# EAGLE board ArduSatMultipleProcessorModule (EAGLE 6.3), part 1 of 2
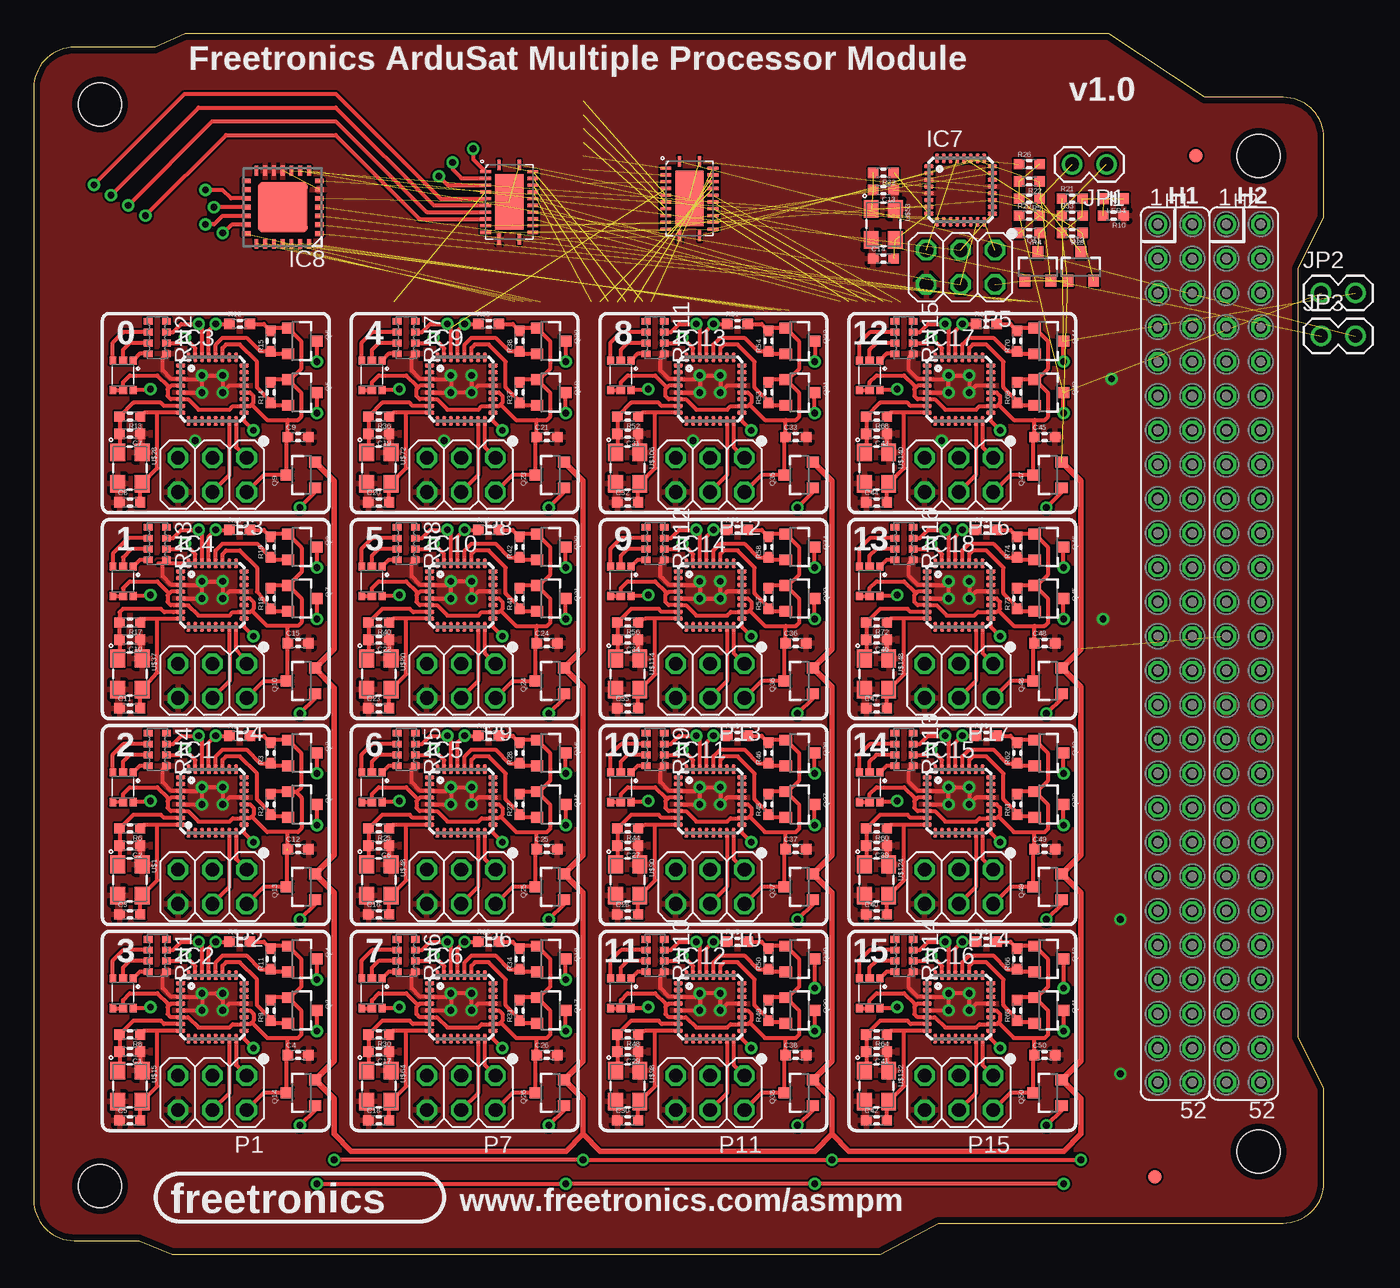
[diagram p2: board, top side]
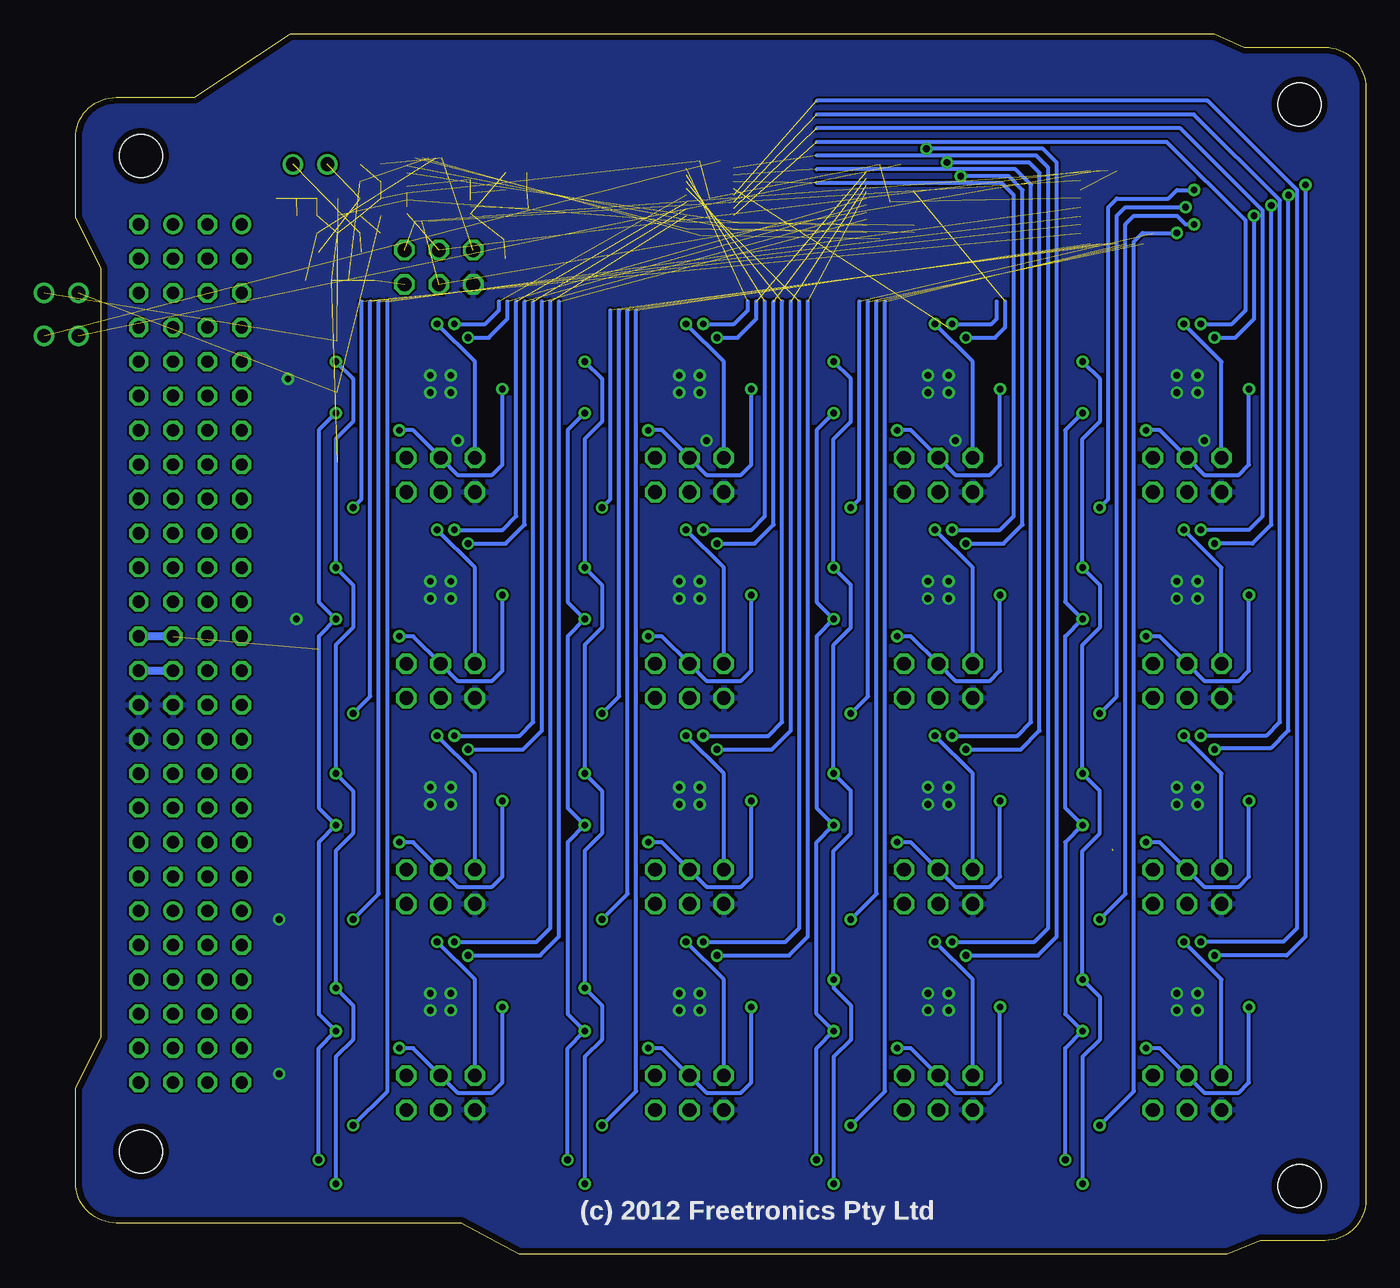
[diagram p3: board, bottom side, seen from below]

Size 95.45 x 90.3 mm. Coordinates in mm from the lower left corner, seen from the top.
Outline: 0,4 arc90 3,1 7.81,1 10.23,0 62.65,0 66.94,2.3 92.45,2.3 arc90 95.45,5.3 95.45,12.31 93.55,16.05 93.55,72.91 95.45,76.74 95.45,82.6 arc90 92.45,85.6 86.64,85.6 79.56,90.3 11.2,90.3 9,89.3 3,89.3 arc90 0,86.3 0,4
Copper layers (1*16): Top 0.035mm / dielectric 1.5mm / Bottom 0.035mm
Design rules "default": minimum track width 6mil, minimum drill 24mil, track to track 6mil, track to pad 12mil, pad to pad 12mil, via to via 12mil, smd to smd 8mil, copper to edge 18mil, drill to drill 8mil, minimum pad ring 10mil, minimum via ring 8mil, stop-mask expansion 4mil, vias tented up to drill 0mil, thermal gap 10mil
Holes 3.2 mm at 4.91,5.05 4.91,85.07 90.63,81.26 90.63,7.6

## Footprints (pad centres in the part's own frame; a part is rotated, then mirrored left to right if it is on the bottom)
0603 = smd 0.762 x 0.762: 1 -0.762,0; 2 0.762,0
CUBESATBUS = drill 0.914: 1 -31.75,-1.27; 41 19.05,-1.27 | drill 0.914 octagon: 2 -31.75,1.27; 3 -29.21,-1.27; 4 -29.21,1.27; 5 -26.67,-1.27; 6 -26.67,1.27; 7 -24.13,-1.27; 8 -24.13,1.27; 9 -21.59,-1.27; 10 -21.59,1.27; 11 -19.05,-1.27; 12 -19.05,1.27; 13 -16.51,-1.27; 14 -16.51,1.27; 15 -13.97,-1.27; 16 -13.97,1.27; 17 -11.43,-1.27; 18 -11.43,1.27; 19 -8.89,-1.27; 20 -8.89,1.27; 21 -6.35,-1.27; 22 -6.35,1.27; 23 -3.81,-1.27; 24 -3.81,1.27; 25 -1.27,-1.27; 26 -1.27,1.27; 27 1.27,-1.27; 28 1.27,1.27; 29 3.81,-1.27; 30 3.81,1.27; 31 6.35,-1.27; 32 6.35,1.27; 33 8.89,-1.27; 34 8.89,1.27; 35 11.43,-1.27; 36 11.43,1.27; 37 13.97,-1.27; 38 13.97,1.27; 39 16.51,-1.27; 40 16.51,1.27; 42 19.05,1.27; 43 21.59,-1.27; 44 21.59,1.27; 45 24.13,-1.27; 46 24.13,1.27; 47 26.67,-1.27; 48 26.67,1.27; 49 29.21,-1.27; 50 29.21,1.27; 51 31.75,-1.27; 52 31.75,1.27
MLF32 = smd 0.7 x 0.3: 1 -2.35,1.75; 2 -2.35,1.25; 3 -2.35,0.75; 4 -2.35,0.25; 5 -2.35,-0.25; 6 -2.35,-0.75; 7 -2.35,-1.25; 8 -2.35,-1.75; 17 2.35,-1.75; 18 2.35,-1.25; 19 2.35,-0.75; 20 2.35,-0.25; 21 2.35,0.25; 22 2.35,0.75; 23 2.35,1.25; 24 2.35,1.75 | smd 0.3 x 0.7: 9 -1.75,-2.35; 10 -1.25,-2.35; 11 -0.75,-2.35; 12 -0.25,-2.35; 13 0.25,-2.35; 14 0.75,-2.35; 15 1.25,-2.35; 16 1.75,-2.35; 25 1.75,2.35; 26 1.25,2.35; 27 0.75,2.35; 28 0.25,2.35; 29 -0.25,2.35; 30 -0.75,2.35; 31 -1.25,2.35; 32 -1.75,2.35
QFN28-ML_6X6MM = smd 0.7 x 0.35: 1 -2.7,1.95; 2 -2.7,1.3; 3 -2.7,0.65; 4 -2.7,0; 5 -2.7,-0.65; 6 -2.7,-1.3; 7 -2.7,-1.95; 15 2.7,-1.95; 16 2.7,-1.3; 17 2.7,-0.65; 18 2.7,0; 19 2.7,0.65; 20 2.7,1.3; 21 2.7,1.95 | smd 0.35 x 0.7: 8 -1.95,-2.7; 9 -1.3,-2.7; 10 -0.65,-2.7; 11 0,-2.7; 12 0.65,-2.7; 13 1.3,-2.7; 14 1.95,-2.7; 22 1.95,2.7; 23 1.3,2.7; 24 0.65,2.7; 25 0,2.7; 26 -0.65,2.7; 27 -1.3,2.7; 28 -1.95,2.7 | smd 3.7 x 3.7: EXP 0,0
1X02 = drill 1.016: 1 0,0; 2 2.54,0
LED-0603 = smd 0.8 x 0.8: A 0,-0.75; C 0,0.75
2X03PTH = drill 1.016 octagon: 1 -2.54,-1.27; 2 -2.54,1.27; 3 0,-1.27; 4 0,1.27; 5 2.54,-1.27; 6 2.54,1.27
SOT23-3 = smd 0.8 x 0.9: 1 -0.95,-1; 2 0.95,-1; 3 0,1.1
CAY16 = smd 0.5 x 0.65: 1 -1.2,-0.675; 2 -0.4,-0.675; 3 0.4,-0.675; 4 1.2,-0.675; 5 1.2,0.675; 6 0.4,0.675; 7 -0.4,0.675; 8 -1.2,0.675
CRYSTAL-SMD-3X2 = smd 1.3 x 1.1: 1 -1.15,-0.9; 2 1.15,-0.9; 3 1.15,0.9; 4 -1.15,0.9
19-337 = smd 0.6 x 0.5: 1 -1.1,0.75; 3 -1.1,-0.75; 4 1.1,0.75; 6 1.1,-0.75 | smd 0.6 x 0.6: 2 -1.1,0; 5 1.1,0
FIDUCIAL-1X2.5 = smd 1 x 1: 1 0,0
DHVQFN24 = smd 0.8 x 0.23: 1 -2.75,-0.75; 12 2.75,-0.75; 13 2.75,0.75; 24 -2.75,0.75 | smd 0.24 x 0.8: 2 -2.25,-1.75 | smd 0.23 x 0.8: 3 -1.75,-1.75; 4 -1.25,-1.75; 5 -0.75,-1.75; 6 -0.25,-1.75; 7 0.25,-1.75; 8 0.75,-1.75; 9 1.25,-1.75; 10 1.75,-1.75; 11 2.25,-1.75; 14 2.25,1.75; 15 1.75,1.75; 16 1.25,1.75; 17 0.75,1.75; 18 0.25,1.75; 19 -0.25,1.75; 20 -0.75,1.75; 21 -1.25,1.75; 22 -1.75,1.75; 23 -2.25,1.75 | smd 4.1 x 2.1: 25 0,0

## Placement (x,y rotation side)
C1  22pF 0603  [0603]  7.11,14.99 180 top
C2  22pF 0603  [0603]  7.11,30.23 180 top
C3  22pF 0603  [0603]  7.11,25.15 0 top
C4  100nF 0603  [0603]  19.56,14.73 0 top
C5  22pF 0603  [0603]  7.11,9.91 0 top
C6  22pF 0603  [0603]  25.53,30.23 180 top
C7  22pF 0603  [0603]  7.11,60.71 180 top
C8  22pF 0603  [0603]  7.11,55.63 0 top
C9  100nF 0603  [0603]  19.56,60.45 0 top
C10  22pF 0603  [0603]  7.11,45.47 180 top
C11  22pF 0603  [0603]  7.11,40.39 0 top
C12  100nF 0603  [0603]  19.56,29.97 0 top
C13  22pF 0603  [0603]  62.87,78.74 180 top
C14  22pF 0603  [0603]  62.87,73.66 0 top
C15  100nF 0603  [0603]  19.56,45.21 0 top
C16  22pF 0603  [0603]  25.53,25.15 0 top
C17  22pF 0603  [0603]  25.53,14.99 180 top
C18  22pF 0603  [0603]  25.53,9.91 0 top
C19  22pF 0603  [0603]  25.53,60.71 180 top
C20  22pF 0603  [0603]  25.53,55.63 0 top
C21  100nF 0603  [0603]  37.97,60.45 0 top
C22  22pF 0603  [0603]  25.53,45.47 180 top
C23  22pF 0603  [0603]  25.53,40.39 0 top
C24  100nF 0603  [0603]  37.97,45.21 0 top
C25  100nF 0603  [0603]  37.97,29.97 0 top
C26  100nF 0603  [0603]  37.97,14.73 0 top
C27  22pF 0603  [0603]  43.94,30.23 180 top
C28  22pF 0603  [0603]  43.94,25.15 0 top
C29  22pF 0603  [0603]  43.94,14.99 180 top
C30  22pF 0603  [0603]  43.94,9.91 0 top
C31  22pF 0603  [0603]  43.94,60.71 180 top
C32  22pF 0603  [0603]  43.94,55.63 0 top
C33  100nF 0603  [0603]  56.39,60.45 0 top
C34  22pF 0603  [0603]  43.94,45.47 180 top
C35  22pF 0603  [0603]  43.94,40.39 0 top
C36  100nF 0603  [0603]  56.39,45.21 0 top
C37  100nF 0603  [0603]  56.39,29.97 0 top
C38  100nF 0603  [0603]  56.39,14.73 0 top
C39  22pF 0603  [0603]  62.36,30.23 180 top
C40  22pF 0603  [0603]  62.36,25.15 0 top
C41  22pF 0603  [0603]  62.36,14.99 180 top
C42  22pF 0603  [0603]  62.36,9.91 0 top
C43  22pF 0603  [0603]  62.36,60.71 180 top
C44  22pF 0603  [0603]  62.36,55.63 0 top
C45  100nF 0603  [0603]  74.8,60.45 0 top
C46  22pF 0603  [0603]  62.36,45.47 180 top
C47  22pF 0603  [0603]  62.36,40.39 0 top
C48  100nF 0603  [0603]  74.8,45.21 0 top
C49  100nF 0603  [0603]  74.8,29.97 0 top
C50  100nF 0603  [0603]  74.8,14.73 0 top
H1  CUBESATBUSH  [CUBESATBUS]  84.44,44.45 270 top
H2  CUBESATBUSH  [CUBESATBUS]  89.52,44.45 270 top
IC1  ATMEGA328P  [MLF32]  13.21,33.53 0 top
IC2  ATMEGA328P  [MLF32]  13.21,18.29 0 top
IC3  ATMEGA328P  [MLF32]  13.21,64.01 0 top
IC4  ATMEGA328P  [MLF32]  13.21,48.77 0 top
IC5  ATMEGA328P  [MLF32]  31.62,33.53 0 top
IC6  ATMEGA328P  [MLF32]  31.62,18.29 0 top
IC7  ATMEGA328P  [MLF32]  68.58,78.74 0 top
IC8  MCP23S17ML  [QFN28-ML_6X6MM]  18.41,77.47 180 top
IC9  ATMEGA328P  [MLF32]  31.62,64.01 0 top
IC10  ATMEGA328P  [MLF32]  31.62,48.77 0 top
IC11  ATMEGA328P  [MLF32]  50.04,33.53 0 top
IC12  ATMEGA328P  [MLF32]  50.04,18.29 0 top
IC13  ATMEGA328P  [MLF32]  50.04,64.01 0 top
IC14  ATMEGA328P  [MLF32]  50.04,48.77 0 top
IC15  ATMEGA328P  [MLF32]  68.45,33.53 0 top
IC16  ATMEGA328P  [MLF32]  68.45,18.29 0 top
IC17  ATMEGA328P  [MLF32]  68.45,64.01 0 top
IC18  ATMEGA328P  [MLF32]  68.45,48.77 0 top
JP1  [1X02]  79.38,80.64 180 top
JP2  [1X02]  95.25,71.12 0 top
JP3  [1X02]  95.25,67.94 0 top
LED4  PWR/BLUE  [LED-0603]  79.88,78.11 90 top
P1  N1_ICSP  [2X03PTH]  13.21,11.94 180 top
P2  N0_ICSP  [2X03PTH]  13.21,27.18 180 top
P3  N0_ICSP  [2X03PTH]  13.21,57.66 180 top
P4  N1_ICSP  [2X03PTH]  13.21,42.42 180 top
P5  N1_ICSP  [2X03PTH]  68.58,73.03 180 top
P6  N0_ICSP  [2X03PTH]  31.62,27.18 180 top
P7  N1_ICSP  [2X03PTH]  31.62,11.94 180 top
P8  N0_ICSP  [2X03PTH]  31.62,57.66 180 top
P9  N1_ICSP  [2X03PTH]  31.62,42.42 180 top
P10  N0_ICSP  [2X03PTH]  50.04,27.18 180 top
P11  N1_ICSP  [2X03PTH]  50.04,11.94 180 top
P12  N0_ICSP  [2X03PTH]  50.04,57.66 180 top
P13  N1_ICSP  [2X03PTH]  50.04,42.42 180 top
P14  N0_ICSP  [2X03PTH]  68.45,27.18 180 top
P15  N1_ICSP  [2X03PTH]  68.45,11.94 180 top
P16  N0_ICSP  [2X03PTH]  68.45,57.66 180 top
P17  N1_ICSP  [2X03PTH]  68.45,42.42 180 top
Q1  BSS138 N-MOSFET  [SOT23-3]  19.81,33.27 270 top
Q2  BSS138 N-MOSFET  [SOT23-3]  19.81,37.08 270 top
Q3  BSS138 N-MOSFET  [SOT23-3]  19.81,18.03 270 top
Q4  BSS138 N-MOSFET  [SOT23-3]  19.81,21.84 270 top
Q5  BSS138 N-MOSFET  [SOT23-3]  19.81,63.75 270 top
Q6  BSS138 N-MOSFET  [SOT23-3]  19.81,67.56 270 top
Q7  BSS138 N-MOSFET  [SOT23-3]  19.81,48.51 270 top
Q8  BSS138 N-MOSFET  [SOT23-3]  19.81,52.32 270 top
Q9  2N7002 N-MOSFET  [SOT23-3]  19.81,57.66 90 top
Q10  2N7002 N-MOSFET  [SOT23-3]  19.81,42.42 90 top
Q11  BSS138 N-MOSFET  [SOT23-3]  74.3,73.03 0 top
Q12  BSS138 N-MOSFET  [SOT23-3]  77.47,73.03 0 top
Q13  2N7002 N-MOSFET  [SOT23-3]  19.81,27.18 90 top
Q14  2N7002 N-MOSFET  [SOT23-3]  19.81,11.94 90 top
Q15  BSS138 N-MOSFET  [SOT23-3]  38.23,33.27 270 top
Q16  BSS138 N-MOSFET  [SOT23-3]  38.23,37.08 270 top
Q17  BSS138 N-MOSFET  [SOT23-3]  38.23,18.03 270 top
Q18  BSS138 N-MOSFET  [SOT23-3]  38.23,21.84 270 top
Q19  BSS138 N-MOSFET  [SOT23-3]  38.23,63.75 270 top
Q20  BSS138 N-MOSFET  [SOT23-3]  38.23,67.56 270 top
Q21  BSS138 N-MOSFET  [SOT23-3]  38.23,48.51 270 top
Q22  BSS138 N-MOSFET  [SOT23-3]  38.23,52.32 270 top
Q23  2N7002 N-MOSFET  [SOT23-3]  38.23,57.66 90 top
Q24  2N7002 N-MOSFET  [SOT23-3]  38.23,42.42 90 top
Q25  2N7002 N-MOSFET  [SOT23-3]  38.23,27.18 90 top
Q26  2N7002 N-MOSFET  [SOT23-3]  38.23,11.94 90 top
Q27  BSS138 N-MOSFET  [SOT23-3]  56.64,33.27 270 top
Q28  BSS138 N-MOSFET  [SOT23-3]  56.64,37.08 270 top
Q29  BSS138 N-MOSFET  [SOT23-3]  56.64,18.03 270 top
Q30  BSS138 N-MOSFET  [SOT23-3]  56.64,21.84 270 top
Q31  BSS138 N-MOSFET  [SOT23-3]  56.64,63.75 270 top
Q32  BSS138 N-MOSFET  [SOT23-3]  56.64,67.56 270 top
Q33  BSS138 N-MOSFET  [SOT23-3]  56.64,48.51 270 top
Q34  BSS138 N-MOSFET  [SOT23-3]  56.64,52.32 270 top
Q35  2N7002 N-MOSFET  [SOT23-3]  56.64,57.66 90 top
Q36  2N7002 N-MOSFET  [SOT23-3]  56.64,42.42 90 top
Q37  2N7002 N-MOSFET  [SOT23-3]  56.64,27.18 90 top
Q38  2N7002 N-MOSFET  [SOT23-3]  56.64,11.94 90 top
Q39  BSS138 N-MOSFET  [SOT23-3]  75.06,33.27 270 top
Q40  BSS138 N-MOSFET  [SOT23-3]  75.06,37.08 270 top
Q41  BSS138 N-MOSFET  [SOT23-3]  75.06,18.03 270 top
Q42  BSS138 N-MOSFET  [SOT23-3]  75.06,21.84 270 top
Q43  BSS138 N-MOSFET  [SOT23-3]  75.06,63.75 270 top
Q44  BSS138 N-MOSFET  [SOT23-3]  75.06,67.56 270 top
Q45  BSS138 N-MOSFET  [SOT23-3]  75.06,48.51 270 top
Q46  BSS138 N-MOSFET  [SOT23-3]  75.06,52.32 270 top
Q47  2N7002 N-MOSFET  [SOT23-3]  75.06,57.66 90 top
Q48  2N7002 N-MOSFET  [SOT23-3]  75.06,42.42 90 top
Q49  2N7002 N-MOSFET  [SOT23-3]  75.06,27.18 90 top
Q50  2N7002 N-MOSFET  [SOT23-3]  75.06,11.94 90 top
R1  22K 0603  [0603]  15.24,38.35 0 top
R2  10K 0603  [0603]  17.53,33.27 90 top
R3  10K 0603  [0603]  17.53,37.08 90 top
R4  100K 0603  [0603]  73.66,75.56 180 top
R5  100K 0603  [0603]  73.66,78.11 180 top
R6  1M 0603  [0603]  7.11,31.5 180 top
R7  22K 0603  [0603]  15.24,23.11 0 top
R8  1M 0603  [0603]  7.11,16.26 180 top
R9  10K 0603  [0603]  17.53,18.03 90 top
R10  2K2 0603  [0603]  79.88,76.83 180 top
R11  10K 0603  [0603]  17.53,21.84 90 top
R12  22K 0603  [0603]  15.24,68.83 0 top
R13  1M 0603  [0603]  7.11,61.98 180 top
R14  10K 0603  [0603]  17.53,63.75 90 top
R15  10K 0603  [0603]  17.53,67.56 90 top
R16  22K 0603  [0603]  15.24,53.59 0 top
R17  1M 0603  [0603]  7.11,46.74 180 top
R18  10K 0603  [0603]  17.53,48.51 90 top
R19  10K 0603  [0603]  17.53,52.32 90 top
R20  100K 0603  [0603]  73.66,76.83 0 top
R21  100K 0603  [0603]  76.83,78.11 0 top
R22  10K 0603  [0603]  73.66,79.38 180 top
R23  10K 0603  [0603]  76.83,75.56 180 top
R24  22K 0603  [0603]  33.66,38.35 0 top
R25  1M 0603  [0603]  25.53,31.5 180 top
R26  22K 0603  [0603]  73.66,80.64 0 top
R27  10K 0603  [0603]  35.94,33.27 90 top
R28  10K 0603  [0603]  35.94,37.08 90 top
R29  22K 0603  [0603]  33.66,23.11 0 top
R30  1M 0603  [0603]  25.53,16.26 180 top
R31  10K 0603  [0603]  35.94,18.03 90 top
R32  1M 0603  [0603]  62.87,80.01 180 top
R33  33K 0603  [0603]  76.83,76.83 0 top
R34  10K 0603  [0603]  35.94,21.84 90 top
R35  22K 0603  [0603]  33.66,68.83 0 top
R36  1M 0603  [0603]  25.53,61.98 180 top
R37  10K 0603  [0603]  35.94,63.75 90 top
R38  10K 0603  [0603]  35.94,67.56 90 top
R39  22K 0603  [0603]  33.66,53.59 0 top
R40  1M 0603  [0603]  25.53,46.74 180 top
R41  10K 0603  [0603]  35.94,48.51 90 top
R42  10K 0603  [0603]  35.94,52.32 90 top
R43  22K 0603  [0603]  52.07,38.35 0 top
R44  1M 0603  [0603]  43.94,31.5 180 top
R45  10K 0603  [0603]  54.36,33.27 90 top
R46  10K 0603  [0603]  54.36,37.08 90 top
R47  22K 0603  [0603]  52.07,23.11 0 top
R48  1M 0603  [0603]  43.94,16.26 180 top
R49  10K 0603  [0603]  54.36,18.03 90 top
R50  10K 0603  [0603]  54.36,21.84 90 top
R51  22K 0603  [0603]  52.07,68.83 0 top
R52  1M 0603  [0603]  43.94,61.98 180 top
R53  10K 0603  [0603]  54.36,63.75 90 top
R54  10K 0603  [0603]  54.36,67.56 90 top
R55  22K 0603  [0603]  52.07,53.59 0 top
R56  1M 0603  [0603]  43.94,46.74 180 top
R57  10K 0603  [0603]  54.36,48.51 90 top
R58  10K 0603  [0603]  54.36,52.32 90 top
R59  22K 0603  [0603]  70.48,38.35 0 top
R60  1M 0603  [0603]  62.36,31.5 180 top
R61  10K 0603  [0603]  72.77,33.27 90 top
R62  10K 0603  [0603]  72.77,37.08 90 top
R63  22K 0603  [0603]  70.48,23.11 0 top
R64  1M 0603  [0603]  62.36,16.26 180 top
R65  10K 0603  [0603]  72.77,18.03 90 top
R66  10K 0603  [0603]  72.77,21.84 90 top
R67  22K 0603  [0603]  70.48,68.83 0 top
R68  1M 0603  [0603]  62.36,61.98 180 top
R69  10K 0603  [0603]  72.77,63.75 90 top
R70  10K 0603  [0603]  72.77,67.56 90 top
R71  22K 0603  [0603]  70.48,53.59 0 top
R72  1M 0603  [0603]  62.36,46.74 180 top
R73  10K 0603  [0603]  72.77,48.51 90 top
R74  10K 0603  [0603]  72.77,52.32 90 top
RN1  2K2  [CAY16]  9.14,22.1 90 top
RN2  2K2  [CAY16]  9.14,67.82 90 top
RN3  2K2  [CAY16]  9.14,52.58 90 top
RN4  2K2  [CAY16]  9.14,37.34 90 top
RN5  2K2  [CAY16]  27.56,37.34 90 top
RN6  2K2  [CAY16]  27.56,22.1 90 top
RN7  2K2  [CAY16]  27.56,67.82 90 top
RN8  2K2  [CAY16]  27.56,52.58 90 top
RN9  2K2  [CAY16]  45.97,37.34 90 top
RN10  2K2  [CAY16]  45.97,22.1 90 top
RN11  2K2  [CAY16]  45.97,67.82 90 top
RN12  2K2  [CAY16]  45.97,52.58 90 top
RN13  2K2  [CAY16]  64.39,37.34 90 top
RN14  2K2  [CAY16]  64.39,22.1 90 top
RN15  2K2  [CAY16]  64.39,67.82 90 top
RN16  2K2  [CAY16]  64.39,52.58 90 top
U$1  CRYSTAL-GND3X2  [CRYSTAL-SMD-3X2]  7.11,27.69 270 top
U$9  RGBLEDSMT  [19-337]  6.6,34.54 270 top
U$15  CRYSTAL-GND3X2  [CRYSTAL-SMD-3X2]  7.11,12.45 270 top
U$16  RGBLEDSMT  [19-337]  6.6,19.3 270 top
U$21  FIDUCIAL1X2.5  [FIDUCIAL-1X2.5]  85.98,81.28 0 top
U$22  FIDUCIAL1X2.5  [FIDUCIAL-1X2.5]  82.93,5.71 0 top
U$28  CRYSTAL-GND3X2  [CRYSTAL-SMD-3X2]  7.11,58.17 270 top
U$29  RGBLEDSMT  [19-337]  6.6,65.02 270 top
U$37  CRYSTAL-GND3X2  [CRYSTAL-SMD-3X2]  7.11,42.93 270 top
U$38  RGBLEDSMT  [19-337]  6.6,49.78 270 top
U$48  CRYSTAL-GND3X2  [CRYSTAL-SMD-3X2]  25.53,27.69 270 top
U$49  RGBLEDSMT  [19-337]  25.02,34.54 270 top
U$53  CRYSTAL-GND3X2  [CRYSTAL-SMD-3X2]  62.87,76.2 270 top
U$59  MUX-74HC4067-QFNSMT  [DHVQFN24]  48.51,78.11 270 top
U$60  MUX-74HC4067-QFNSMT  [DHVQFN24]  35.18,77.85 270 top
U$64  CRYSTAL-GND3X2  [CRYSTAL-SMD-3X2]  25.53,12.45 270 top
U$65  RGBLEDSMT  [19-337]  25.02,19.3 270 top
U$72  CRYSTAL-GND3X2  [CRYSTAL-SMD-3X2]  25.53,58.17 270 top
U$73  RGBLEDSMT  [19-337]  25.02,65.02 270 top
U$80  CRYSTAL-GND3X2  [CRYSTAL-SMD-3X2]  25.53,42.93 270 top
U$81  RGBLEDSMT  [19-337]  25.02,49.78 270 top
U$90  CRYSTAL-GND3X2  [CRYSTAL-SMD-3X2]  43.94,27.69 270 top
U$91  RGBLEDSMT  [19-337]  43.43,34.54 270 top
U$98  CRYSTAL-GND3X2  [CRYSTAL-SMD-3X2]  43.94,12.45 270 top
U$99  RGBLEDSMT  [19-337]  43.43,19.3 270 top
U$106  CRYSTAL-GND3X2  [CRYSTAL-SMD-3X2]  43.94,58.17 270 top
U$107  RGBLEDSMT  [19-337]  43.43,65.02 270 top
U$114  CRYSTAL-GND3X2  [CRYSTAL-SMD-3X2]  43.94,42.93 270 top
U$115  RGBLEDSMT  [19-337]  43.43,49.78 270 top
U$124  CRYSTAL-GND3X2  [CRYSTAL-SMD-3X2]  62.36,27.69 270 top
U$125  RGBLEDSMT  [19-337]  61.85,34.54 270 top
U$132  CRYSTAL-GND3X2  [CRYSTAL-SMD-3X2]  62.36,12.45 270 top
U$133  RGBLEDSMT  [19-337]  61.85,19.3 270 top
U$140  CRYSTAL-GND3X2  [CRYSTAL-SMD-3X2]  62.36,58.17 270 top
U$141  RGBLEDSMT  [19-337]  61.85,65.02 270 top
U$148  CRYSTAL-GND3X2  [CRYSTAL-SMD-3X2]  62.36,42.93 270 top
U$149  RGBLEDSMT  [19-337]  61.85,49.78 270 top